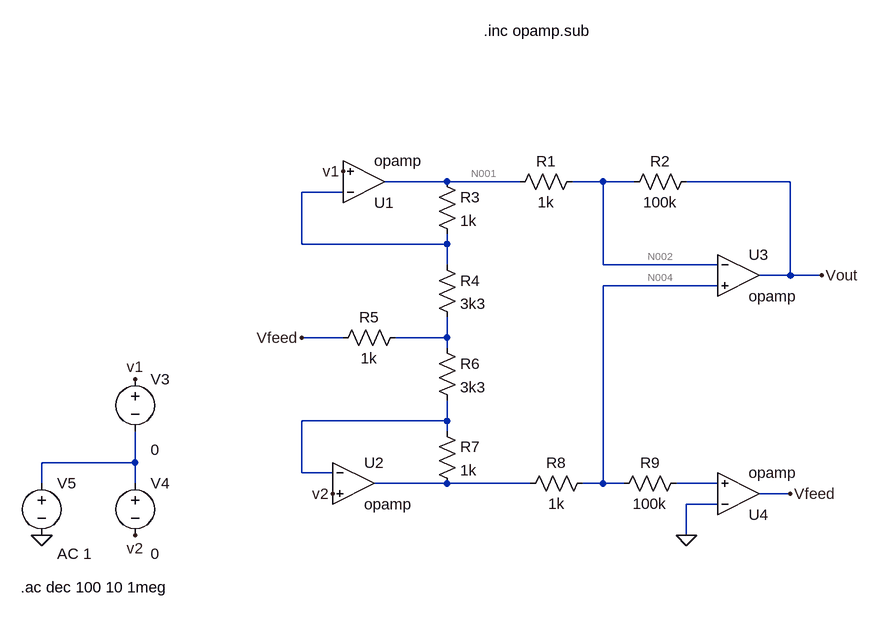
[diagram p0: schematic ej3 tp3 ideal.asc]
ej3 tp3 ideal.asc, the LTspice schematic file:
Version 4
SHEET 1 880 784
WIRE 208 144 112 144
WIRE 320 144 208 144
WIRE 448 144 400 144
WIRE 496 144 448 144
WIRE 736 144 576 144
WIRE 48 160 -16 160
WIRE -16 240 -16 160
WIRE 208 240 208 224
WIRE 208 240 -16 240
WIRE 208 272 208 240
WIRE 448 272 448 144
WIRE 624 272 448 272
WIRE 736 288 736 144
WIRE 736 288 688 288
WIRE 784 288 736 288
WIRE 624 304 448 304
WIRE 48 384 -16 384
WIRE 208 384 208 352
WIRE 208 384 128 384
WIRE 208 400 208 384
WIRE 208 512 208 480
WIRE 208 512 -16 512
WIRE 208 528 208 512
WIRE -272 576 -272 528
WIRE -272 576 -416 576
WIRE -16 592 -16 512
WIRE 32 592 -16 592
WIRE -416 608 -416 576
WIRE -272 608 -272 576
WIRE 208 608 96 608
WIRE 336 608 208 608
WIRE 448 608 448 304
WIRE 448 608 416 608
WIRE 480 608 448 608
WIRE 624 608 560 608
WIRE 736 624 688 624
WIRE 624 640 576 640
WIRE 576 688 576 640
FLAG 576 688 0
FLAG -16 384 Vfeed
FLAG 736 624 Vfeed
FLAG -416 688 0
FLAG -272 448 v1
FLAG 48 128 v1
FLAG 32 624 v2
FLAG -272 688 v2
FLAG 784 288 Vout
SYMBOL Opamps\\opamp 80 208 M180
SYMATTR InstName U1
SYMATTR SpiceLine2 GBW=1000000Meg
SYMBOL Opamps\\opamp 656 224 R0
SYMATTR InstName U3
SYMATTR SpiceLine2 GBW=1000000Meg
SYMBOL Opamps\\opamp 64 544 R0
SYMATTR InstName U2
SYMATTR SpiceLine2 GBW=1000000Meg
SYMBOL Opamps\\opamp 656 688 M180
SYMATTR InstName U4
SYMATTR SpiceLine2 GBW=1000000Meg
SYMBOL res 192 128 R0
SYMATTR InstName R3
SYMATTR Value 1k
SYMBOL res 192 256 R0
SYMATTR InstName R4
SYMATTR Value 3k3
SYMBOL res 192 384 R0
SYMATTR InstName R6
SYMATTR Value 3k3
SYMBOL res 192 512 R0
SYMATTR InstName R7
SYMATTR Value 1k
SYMBOL res 416 128 R90
WINDOW 0 0 56 VBottom 2
WINDOW 3 32 56 VTop 2
SYMATTR InstName R1
SYMATTR Value 1k
SYMBOL res 592 128 R90
WINDOW 0 0 56 VBottom 2
WINDOW 3 32 56 VTop 2
SYMATTR InstName R2
SYMATTR Value 100k
SYMBOL res 432 592 R90
WINDOW 0 0 56 VBottom 2
WINDOW 3 32 56 VTop 2
SYMATTR InstName R8
SYMATTR Value 1k
SYMBOL res 576 592 R90
WINDOW 0 0 56 VBottom 2
WINDOW 3 32 56 VTop 2
SYMATTR InstName R9
SYMATTR Value 100k
SYMBOL res 144 368 R90
WINDOW 0 0 56 VBottom 2
WINDOW 3 32 56 VTop 2
SYMATTR InstName R5
SYMATTR Value 1k
SYMBOL voltage -272 432 R0
WINDOW 123 24 124 Left 2
WINDOW 39 0 0 Left 2
SYMATTR Value2 0
SYMATTR InstName V3
SYMATTR Value ""
SYMBOL voltage -272 592 R0
WINDOW 123 24 124 Left 2
WINDOW 39 0 0 Left 2
SYMATTR Value2 0
SYMATTR InstName V4
SYMATTR Value ""
SYMBOL voltage -416 592 R0
WINDOW 123 24 124 Left 2
WINDOW 39 0 0 Left 2
SYMATTR Value2 AC 1
SYMATTR InstName V5
SYMATTR Value ""
TEXT -448 768 Left 2 !.ac dec 100 10 1meg
TEXT 264 -88 Left 2 !.inc opamp.sub

The netlist it stands for:
* ej3 tp3 ideal.asc
XU1 N003 v1 N001 opamp Aol=100K GBW=1000000Meg  ; pins invin noninvin out
XU3 N002 N004 Vout opamp Aol=100K GBW=1000000Meg  ; pins invin noninvin out
XU2 N006 v2 N008 opamp Aol=100K GBW=1000000Meg  ; pins invin noninvin out
XU4 0 N009 Vfeed opamp Aol=100K GBW=1000000Meg  ; pins invin noninvin out
R3 N001 N003 1k
R4 N003 N005 3k3
R6 N005 N006 3k3
R7 N006 N008 1k
R1 N002 N001 1k
R2 Vout N002 100k
R8 N004 N008 1k
R9 N009 N004 100k
R5 N005 Vfeed 1k
V3 v1 N007 0
V4 N007 v2 0
V5 N007 0 AC 1
.ac dec 100 10 1meg
.inc opamp.sub
.backanno
.end

* Results of the author's LTspice run, read from the files saved beside the schematic
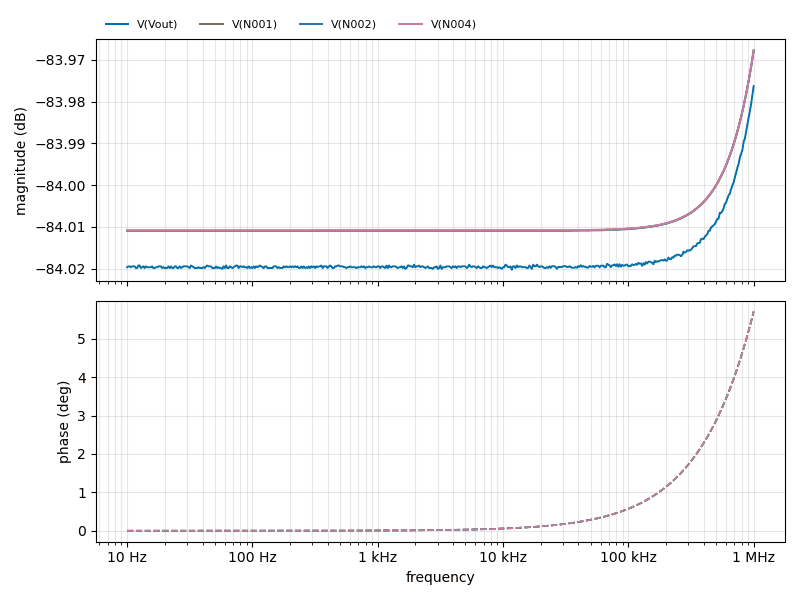
[diagram p1: AC Analysis of ej3 tp3 ideal.asc, plotted from the saved traces]
* AC Analysis, 1 run:
*   V(Vout): -84.02 dB at 10 Hz, -83.98 dB at 1 MHz, peak -83.98 dB at 1 MHz
*   V(N001): -84.01 dB at 10 Hz, -83.97 dB at 1 MHz, peak -83.97 dB at 1 MHz
*   V(N002): -84.01 dB at 10 Hz, -83.97 dB at 1 MHz, peak -83.97 dB at 1 MHz
*   V(N004): -84.01 dB at 10 Hz, -83.97 dB at 1 MHz, peak -83.97 dB at 1 MHz